# Altium schematic sheet STM32F1xx.SchDoc
size A4
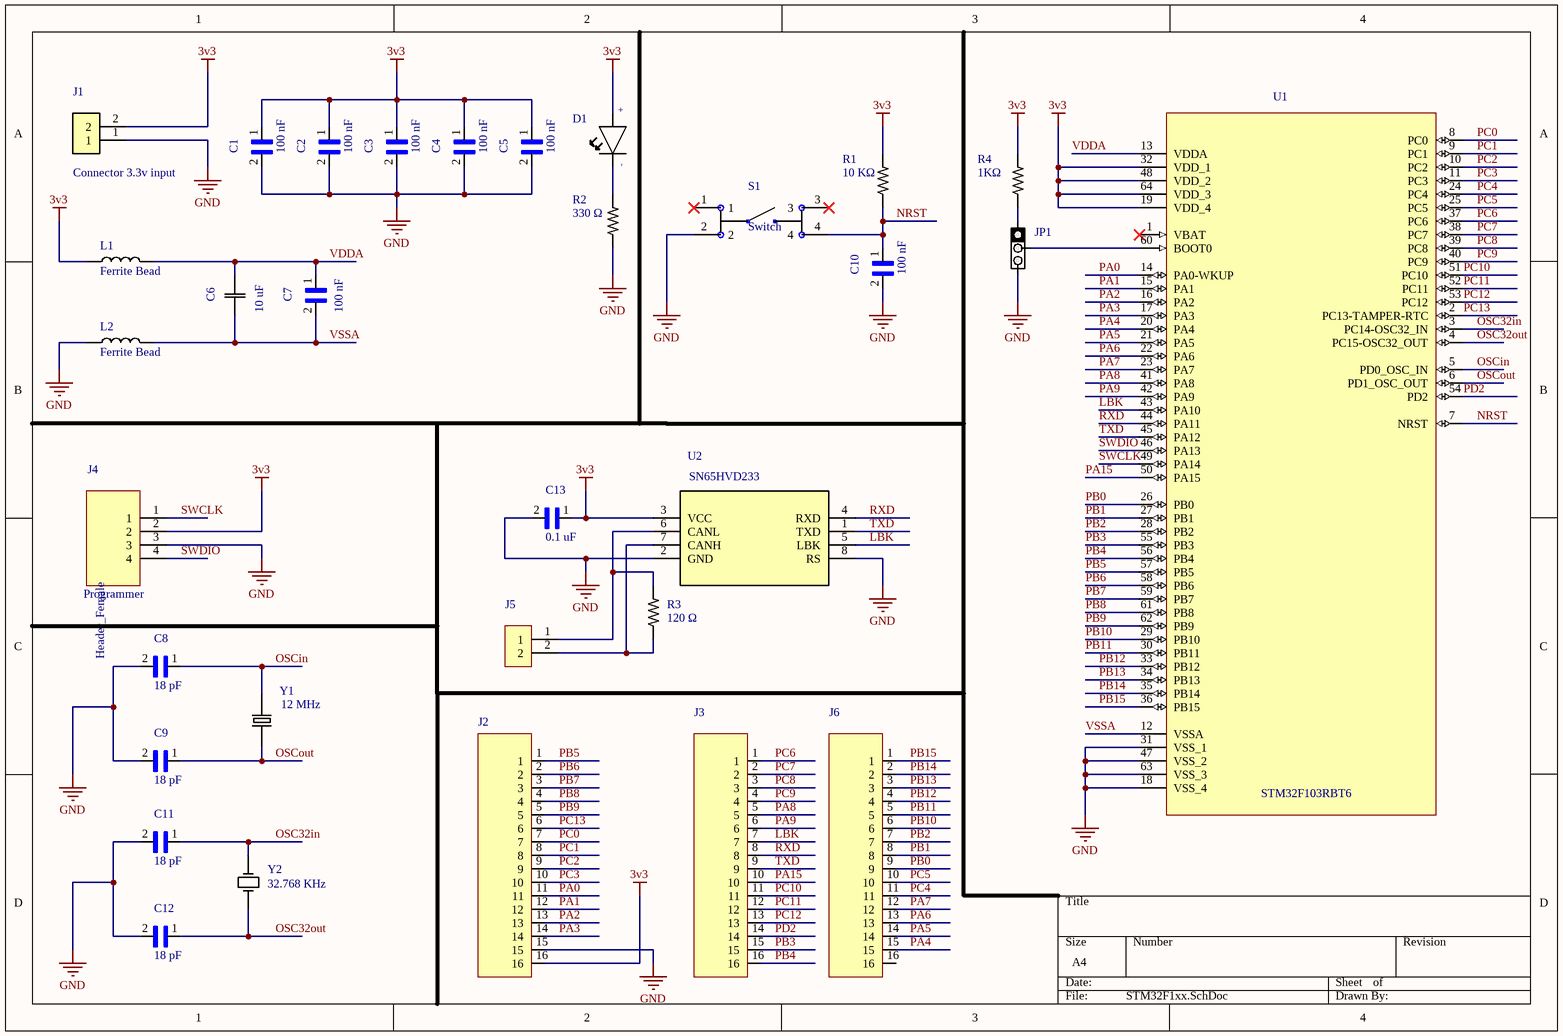
[diagram p0: STM32F1xx.SchDoc]

## Parts
C1  100 nF  [*CAPC2012X135N]
C2  100 nF  [*CAPC2012X135N]
C3  100 nF  [*CAPC2012X135N]
C4  100 nF  [*CAPC2012X135N]
C5  100 nF  [*CAPC2012X135N]
C6  10 uF  [CAPC3216X94N]
C7  100 nF  [*CAPC2012X135N]
C8  18 pF  [*CAPC2012X135N]
C9  18 pF  [*CAPC2012X135N]
C10  100 nF  [*CAPC2012X135N]
C11  18 pF  [*CAPC2012X135N]
C12  18 pF  [*CAPC2012X135N]
C13  0.1 uF  [*CAPC2012X135N]
D1  LED1206  [WL-SMCW_0603]  (value not drawn)
J1  Connector 3.3v input  [*MOLEX_0022272031]
J2  Pin Header  [*TE_9-146281-0]  (value not drawn)
J3  Pin Header  [*TE_9-146281-0]  (value not drawn)
J4  Programmer  [TE_7-534206-0]
J5  Terminal  [TE_1776266-4]  (value not drawn)
J6  Pin Header  [*TE_9-146281-0]  (value not drawn)
JP1  JMPR3  [JMPR3]  (value not drawn)
L1  Ferrite Bead  [*RESC3216X70]
L2  Ferrite Bead  [*RESC3216X70]
R1  10 KΩ  [*RESC2012X65N]
R2  330 Ω  [*RESC2012X65N]
R3  120 Ω  [*RESC2012X65N]
R4  1KΩ  [*RESC2012X65N]
S1  Switch  [SW_FSM4JSMAATR]
U1  STM32F103RBT6  [QFP50P1200X1200X160-64N]  (value not drawn)
U2  SN65HVD233  [*SOIC8]
Y1  12 MHz  [XTAL_ECS-80-18-4X]
Y2  32.768 KHz  [*XTAL_AB38T-32.768KHZ]

## Nets
3v3: C1.1 C2.1 C3.1 C4.1 C5.1 C13.1 D1.2 J1.2 J2.16 J4.2 L1.1 R1.2 R4.2 U1.19(VDD_4) U1.32(VDD_1) U1.48(VDD_2) U1.64(VDD_3) U2.3(VCC)
GND: C1.2 C2.2 C3.2 C4.2 C5.2 C8.2 C9.2 C10.2 C11.2 C12.2 C13.2 J1.1 J2.15 J4.3 JP1.3 L2.1 R2.1 S1.2 U1.18(VSS_4) U1.31(VSS_1) U1.47(VSS_2) U1.63(VSS_3) U2.2(GND) U2.8(RS)
LBK: J3.7 U1.43(PA10) U2.5(LBK)
NRST: C10.1 R1.1 S1.4 U1.7(NRST)
OSC32in: C11.1 U1.3(PC14-OSC32_IN) Y2.1
OSC32out: C12.1 U1.4(PC15-OSC32_OUT) Y2.2
OSCin: C8.1 U1.5(PD0_OSC_IN) Y1.1
OSCout: C9.1 U1.6(PD1_OSC_OUT) Y1.2
PA0: J2.11 U1.14(PA0-WKUP)
PA1: J2.12 U1.15(PA1)
PA2: J2.13 U1.16(PA2)
PA3: J2.14 U1.17(PA3)
PA4: J6.15 U1.20(PA4)
PA5: J6.14 U1.21(PA5)
PA6: J6.13 U1.22(PA6)
PA7: J6.12 U1.23(PA7)
PA8: J3.5 U1.41(PA8)
PA9: J3.6 U1.42(PA9)
PA15: J3.10 U1.50(PA15)
PB0: J6.9 U1.26(PB0)
PB1: J6.8 U1.27(PB1)
PB2: J6.7 U1.28(PB2)
PB3: J3.15 U1.55(PB3)
PB4: J3.16 U1.56(PB4)
PB5: J2.1 U1.57(PB5)
PB6: J2.2 U1.58(PB6)
PB7: J2.3 U1.59(PB7)
PB8: J2.4 U1.61(PB8)
PB9: J2.5 U1.62(PB9)
PB10: J6.6 U1.29(PB10)
PB11: J6.5 U1.30(PB11)
PB12: J6.4 U1.33(PB12)
PB13: J6.3 U1.34(PB13)
PB14: J6.2 U1.35(PB14)
PB15: J6.1 U1.36(PB15)
PC0: J2.7 U1.8(PC0)
PC1: J2.8 U1.9(PC1)
PC2: J2.9 U1.10(PC2)
PC3: J2.10 U1.11(PC3)
PC4: J6.11 U1.24(PC4)
PC5: J6.10 U1.25(PC5)
PC6: J3.1 U1.37(PC6)
PC7: J3.2 U1.38(PC7)
PC8: J3.3 U1.39(PC8)
PC9: J3.4 U1.40(PC9)
PC10: J3.11 U1.51(PC10)
PC11: J3.12 U1.52(PC11)
PC12: J3.13 U1.53(PC12)
PC13: J2.6 U1.2(PC13-TAMPER-RTC)
PD2: J3.14 U1.54(PD2)
RXD: J3.8 U1.44(PA11) U2.4(RXD)
SWCLK: J4.1 U1.49(PA14)
SWDIO: J4.4 U1.46(PA13)
TXD: J3.9 U1.45(PA12) U2.1(TXD)
VDDA: C6.2(C2) C7.1 L1.2 U1.13(VDDA)
VSSA: C6.1(C1) C7.2 L2.2 U1.12(VSSA)
NetD1_1: D1.1 R2.2
NetJ5_1: J5.1 R3.2 U2.6(CANL)
NetJ5_2: J5.2 R3.1 U2.7(CANH)
NetJP1_1: JP1.1 R4.1
NetJP1_2: JP1.2 U1.60(BOOT0)

Not connected (* = marked no-connect by the designer): J6 16; S1 1* 3*; U1 1(VBAT)*

## Notes on the sheet
- (in symbol 7-534206-0) Header_Female
- (in symbol WL-SMCW) +; -

## Library data of the parts
C1-C5 C7-C13 = GCD21BR71H104KA01L: Cap Ceramic 0.1uF 50Vdc X7R 10% SMD 805 125Â°C Embossed T/R; MF: Murata Electronics; Availability: Unavailable; SnapEDA_Link: https://www.snapeda.com/parts/GCD21BR71H104KA01L/Murata%20Electronics%20North%20America/view-part/?ref=snap; Price: None; Package: 0805 Murata; MP: GCD21BR71H104KA01L; Value: *
C6 = 1206YC104KAT2A: 1206 100 nF 16 V Â±10 % Tolerance X7R SMT Multilayer Ceramic Capacitor; MF: AVX; SnapEDA_Link: https://www.snapeda.com/parts/1206YC104KAT2A/AVX/view-part/?ref=snap; Price: None; MP: 1206YC104KAT2A; Availability: Unavailable; Package: 1206 AVX; Value: *
D1 = WL-SMCW: LED, 1206, AMBER, 140MCD, 605NM; Bulb Size: -; LED Colour: Ambre; Luminous Intensi; MF: Wurth Electronics; MP: 150120AS75000; Digi-Key_Purchase_URL: https://www.digikey.com/product-detail/en/wurth-electronics-inc/150120AS75000/732-4988-1-ND/4489928?utm_source=snapeda&utm_medium=aggregator&utm_campaign=symbol; Digi-Key_Part_Number: 732-4988-1-ND; Package: 1206 WÃ¼rth Elektronik; SnapEDA_Link: https://www.snapeda.com/parts/150120AS75000/Wurth%20Electronics%20Inc./view-part/?ref=snap; Value: *
J1 = 0022272031: 2.54mm _.100_ Pitch KKÂ® Wire-to-Board Header, Vertical, with Friction Lock, 3 Circuits, Tin _Sn_ Plating; MF: Molex; Digi-Key_Purchase_URL: https://www.digikey.co.uk/product-detail/en/molex/0022272031/WM4112-ND/1130578?utm_source=snapeda&utm_medium=aggregator&utm_campaign=symbol; Digi-Key_Part_Number: WM4112-ND; Package: None; MP: 0022272031; SnapEDA_Link: https://www.snapeda.com/parts/0022272031/Molex/view-part/?ref=snap; Value: *
J2 J3 J6 = Pin Header: 20 MODII HDR SRST; Created By: Alireza Nami
J4 = 7-534206-0: 40 MODII VRT DR CE 100/115; Number_of_Positions: 40; Product_Type: Connector; MF: TE Connectivity; Centerline_Pitch: 2.54 mm[.1 in]; SnapEDA_Link: https://www.snapeda.com/parts/7-534206-0/TE%20Connectivity%20AMP%20Connectors/view-part/?ref=snap; Price: None; MP: 7-534206-0; EU_RoHS_Compliance: Compliant; Availability: Unavailable; TE_purchase_URL: https://www.te.com/usa-en/product-7-534206-0.html?te_bu=Cor&te_type=disp&te_campaign=seda_glo_cor-seda-global-disp-prtnr-fy19-seda-model-bom-cta_sma-317_1&elqCampaignId=32493; Package: None; Value: *
J5 = Terminal: Conn Terminal Block 2 POS 5mm Screw; MP: 1776266-4; MF: TE Connectivity; SnapEDA_Link: https://www.snapeda.com/parts/1776266-4/TE%20Connectivity%20AMP%20Connectors/view-part/?ref=snap; Price: None; Availability: Unavailable; TE_purchase_URL: https://www.te.com/usa-en/product-1776266-4.html?te_bu=Cor&te_type=disp&te_campaign=seda_glo_cor-seda-global-disp-prtnr-fy19-seda-model-bom-cta_sma-317_1&elqCampaignId=32493; Package: None; Value: *
JP1 = JMPR3: Manufacturer: Sullins Connector Solutions; Manufacturer Part Number: PBC36SAAN; Reel: Open; Supplier 1: Digi-Key; Supplier Part Number 1: S1011E-36-ND
L1 L2 = Ferrite Bead: CHIP BEAD, 1206, 68OHM, 100MHZ, 25%; Inductor Type: Ferrite Bead; Series: EXCML; Tolerance, Inductance: Â± 25%; Resist...; MF: Panasonic; MP: EXCML32A680U; Package: 1206 Panasonic; Price: None; Availability: Unavailable
R1-R4 = CRGH0805F118R: Res Thick Film 0805 118 Ohm 1% 1/3W Â±100ppm/Â°C Molded SMD SMD T/R; MF: TE Connectivity; SnapEDA_Link: https://www.snapeda.com/parts/CRGH0805F118R/TE%20Connectivity%20Passive%20Product/view-part/?ref=snap; Price: None; MP: CRGH0805F118R; TE_purchase_URL: https://www.te.com/usa-en/product-1879509-5.html?te_bu=Cor&te_type=disp&te_campaign=seda_glo_cor-seda-global-disp-prtnr-fy19-seda-model-bom-cta_sma-317_1&elqCampaignId=32493; Availability: Unavailable; Package: 0805 TE Connectivity; Value: *
S1 = FSM4JSMAATR: spst, Tactile / Jog, Industrial Control, Switches, switch, white, smd, tactile; MF: Alco; Price: None; Availability: Unavailable; Package: None; SnapEDA_Link: https://www.snapeda.com/parts/FSM4JSMAATR/Alco/view-part/?ref=snap; MP: FSM4JSMAATR; Value: *
U1 = STM32F103RBT6: Mainstream Performance line, ARM Cortex-M3 MCU with 128 Kbytes Flash, 72 MHz CPU, motor control, USB and CAN; MF: STMicroelectronics; SnapEDA_Link: https://www.snapeda.com/parts/STM32F103RBT6/STMicroelectronics/view-part/?ref=snap; Digi-Key_Purchase_URL: https://www.digikey.de/product-detail/en/stmicroelectronics/STM32F103RBT6/497-6066-ND/1646341?utm_source=snapeda&utm_medium=aggregator&utm_campaign=symbol; MP: STM32F103RBT6; Digi-Key_Part_Number: 497-6066-ND; Package: LQFP-64 STMicroelectronics; Value: *
U2 = SN65HVD233MDREP: Enhanced Product 3.3-V CAN Tranceiver 8-SOIC -55 to 125; MF: Texas Instruments; Digi-Key_Purchase_URL: https://www.digikey.co.uk/product-detail/en/texas-instruments/SN65HVD233MDREP/296-23973-1-ND/1981063?utm_source=snapeda&utm_medium=aggregator&utm_campaign=symbol; SnapEDA_Link: https://www.snapeda.com/parts/SN65HVD233MDREP/Texas%20Instruments/view-part/?ref=snap; MP: SN65HVD233MDREP; Digi-Key_Part_Number: 296-23973-1-ND; Package: SOIC-8 Texas Instruments; Value: *
Y1 = ECS-80-18-4X: HC-49USX Series 8 MHz Â±30 ppm 18 pF -10 to +70 Â°C Through Hole Crystal - HC-49/U; MF: ECS Inc.; SnapEDA_Link: https://www.snapeda.com/parts/ECS-80-18-4X/ECS%20Inc./view-part/?ref=snap; Digi-Key_Purchase_URL: https://www.digikey.co.uk/product-detail/en/ecs-inc/ECS-80-18-4X/X1093-ND/827584?utm_source=snapeda&utm_medium=aggregator&utm_campaign=symbol; MP: ECS-80-18-4X; Digi-Key_Part_Number: X1093-ND; Package: HC49/US ECS International; Value: *
Y2 = AB38T-32.768KHZ: AB38T Series 32.768 kHz Â±20 ppm 12.5 pF -10 to +60 Â°C Tuning Fork Crystal; MF: Abracon; MP: AB38T-32.768KHZ; Package: Cylindrical Can Radial  Abracon; Availability: Unavailable; Price: None; SnapEDA_Link: https://www.snapeda.com/parts/AB38T-32.768KHZ/Abracon%20LLC/view-part/?ref=snap; Value: *